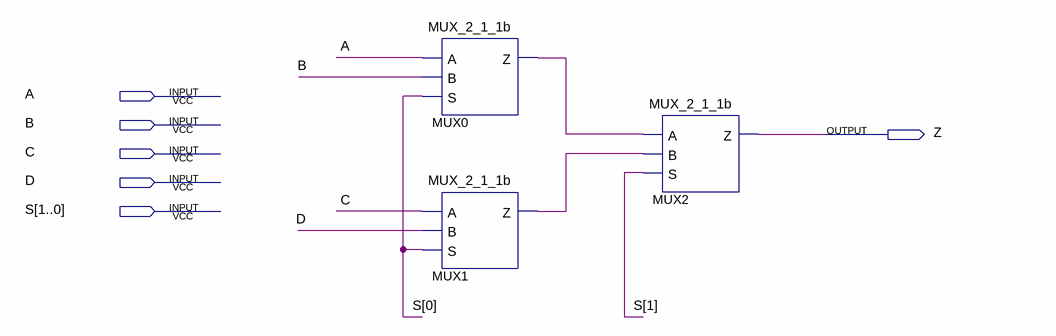
[diagram p0: schematic sheet]
// Quartus schematic MUX_4_1_1b.bdf as structural Verilog: 3 symbols, 6 pins
module MUX_4_1_1b (
  input  A,
  input  B,
  input  C,
  input  D,
  input  [1:0] S,
  output Z
);

  wire MUX0_z, MUX1_z;

  MUX_2_1_1b MUX0 (.A(A), .B(B), .S(S[0]), .Z(MUX0_z));
  MUX_2_1_1b MUX1 (.A(C), .B(D), .S(S[0]), .Z(MUX1_z));
  MUX_2_1_1b MUX2 (.A(MUX0_z), .B(MUX1_z), .S(S[1]), .Z(Z));
endmodule
